# Altium schematic sheet EP4CE10F17C8N_Core.SchDoc
size A3; SheetNumber: 3; SheetTotal: 4
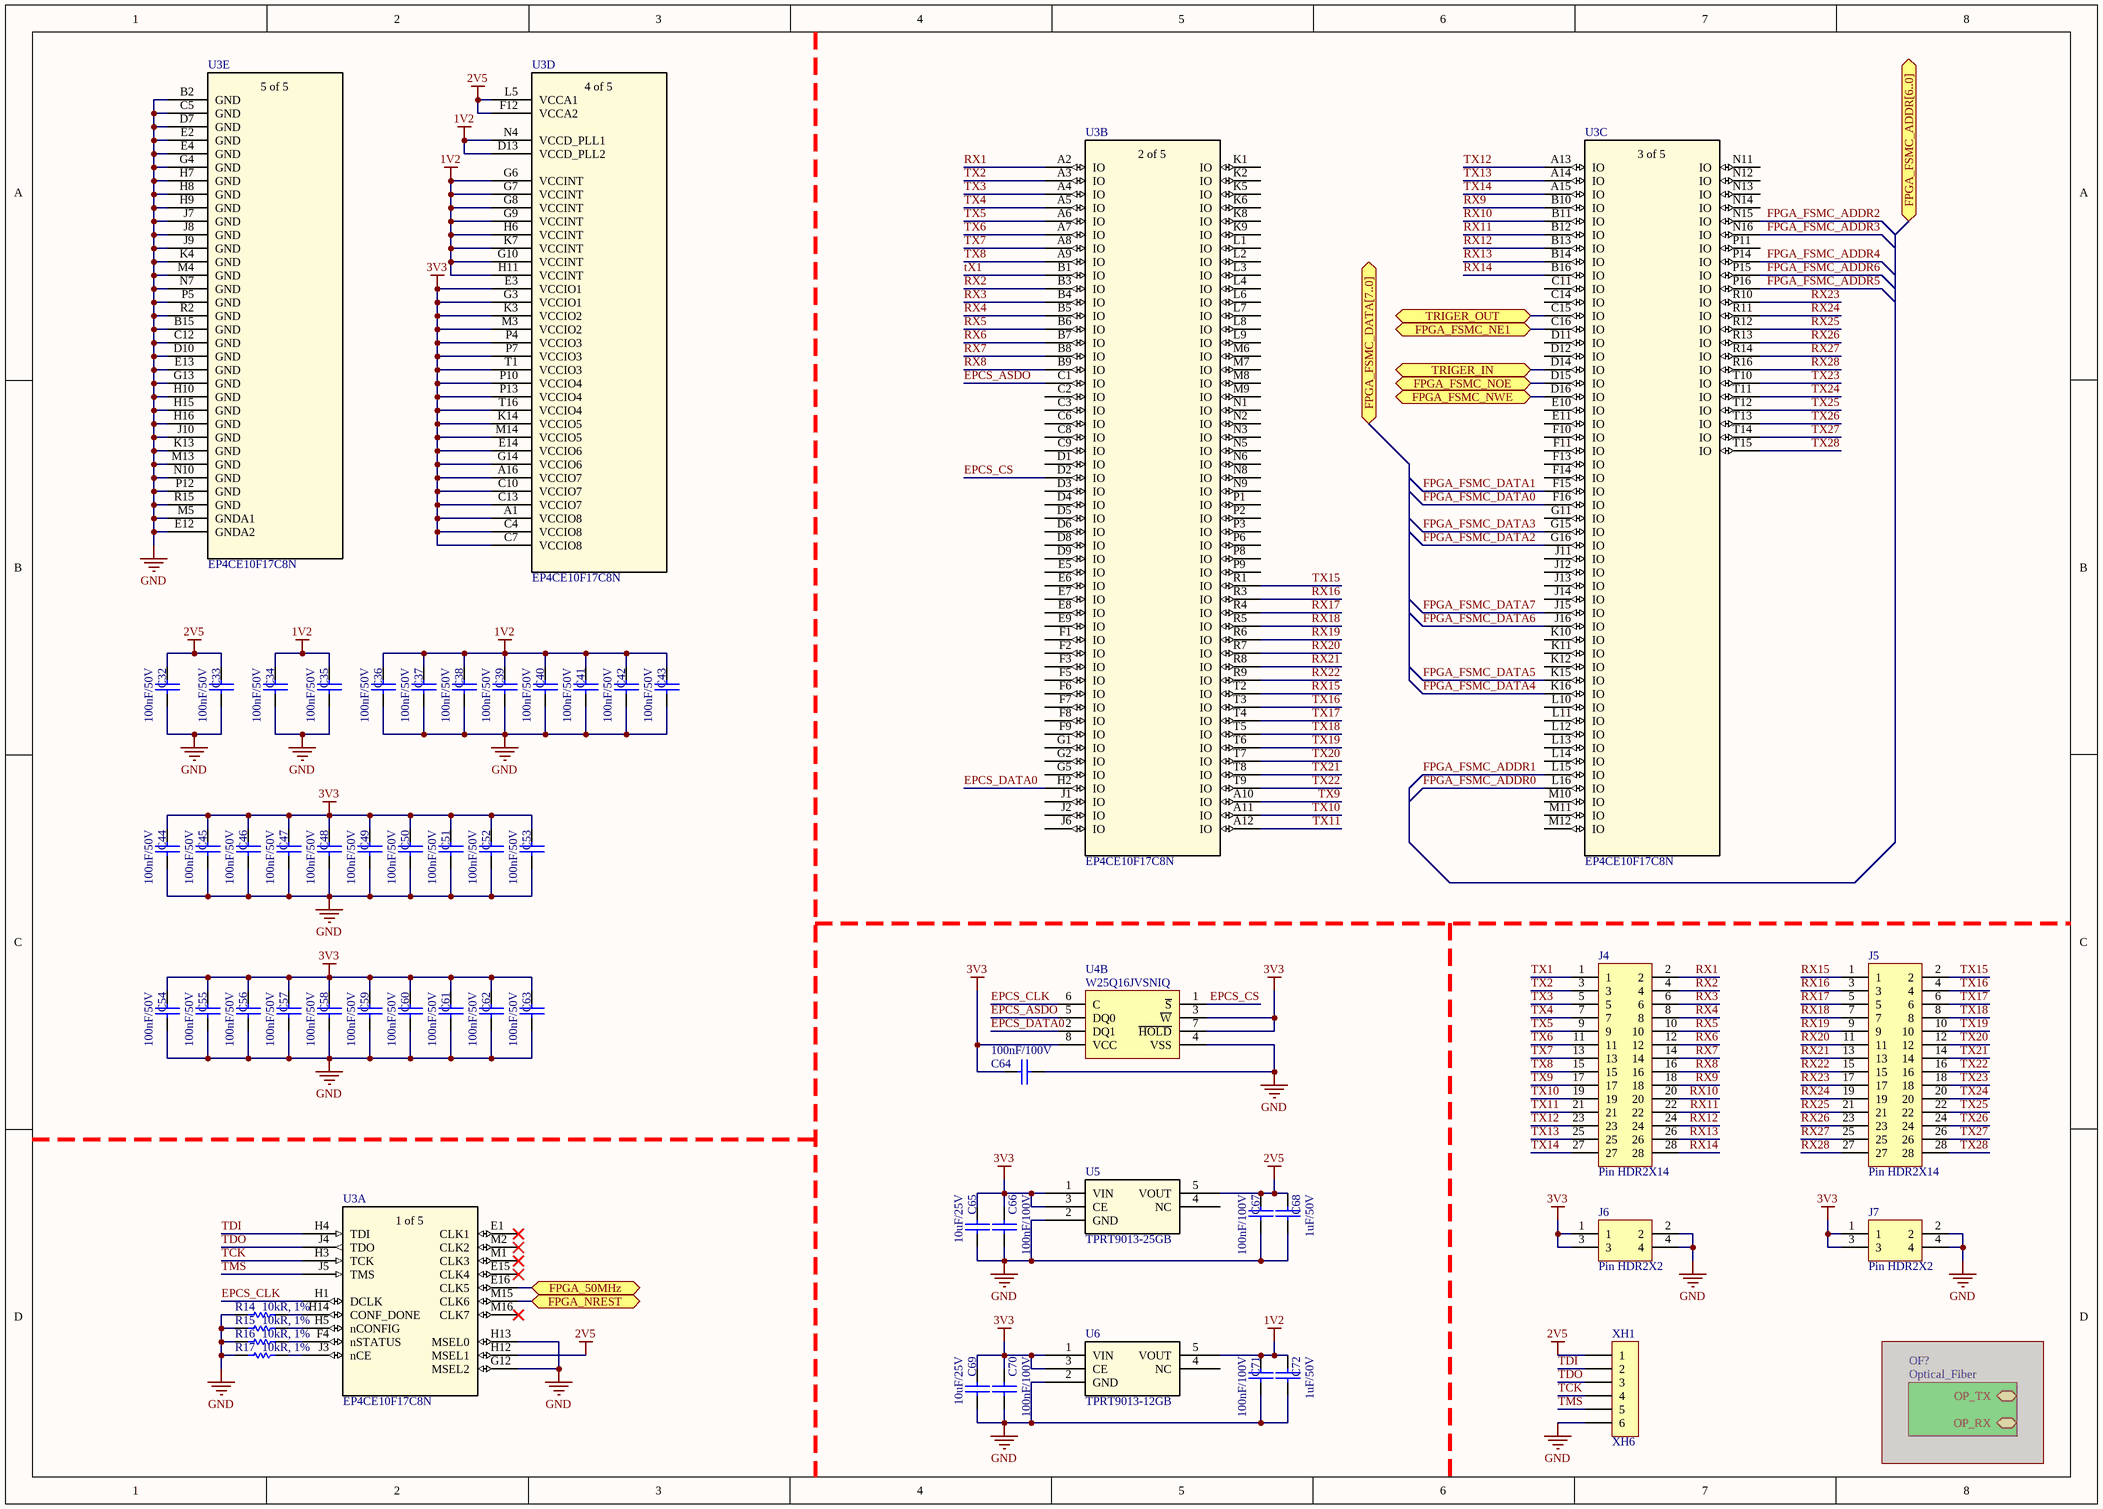
[diagram p0: EP4CE10F17C8N_Core.SchDoc]

## Parts
C32  100nF/50V  [0402C]
C33  100nF/50V  [0402C]
C34  100nF/50V  [0402C]
C35  100nF/50V  [0402C]
C36  100nF/50V  [0402C]
C37  100nF/50V  [0402C]
C38  100nF/50V  [0402C]
C39  100nF/50V  [0402C]
C40  100nF/50V  [0402C]
C41  100nF/50V  [0402C]
C42  100nF/50V  [0402C]
C43  100nF/50V  [0402C]
C44  100nF/50V  [0402C]
C45  100nF/50V  [0402C]
C46  100nF/50V  [0402C]
C47  100nF/50V  [0402C]
C48  100nF/50V  [0402C]
C49  100nF/50V  [0402C]
C50  100nF/50V  [0402C]
C51  100nF/50V  [0402C]
C52  100nF/50V  [0402C]
C53  100nF/50V  [0402C]
C54  100nF/50V  [0402C]
C55  100nF/50V  [0402C]
C56  100nF/50V  [0402C]
C57  100nF/50V  [0402C]
C58  100nF/50V  [0402C]
C59  100nF/50V  [0402C]
C60  100nF/50V  [0402C]
C61  100nF/50V  [0402C]
C62  100nF/50V  [0402C]
C63  100nF/50V  [0402C]
C64  100nF/100V  [0603C]
C65  10uF/25V  [0603C]
C66  100nF/100V  [0603C]
C67  100nF/100V  [0603C]
C68  1uF/50V  [0603C]
C69  10uF/25V  [0603C]
C70  100nF/100V  [0603C]
C71  100nF/100V  [0603C]
C72  1uF/50V  [0603C]
J4  Pin HDR2X14  [Pin HDR2X14/2.54mm-S]
J5  Pin HDR2X14  [Pin HDR2X14/2.54mm-S]
J6  Pin HDR2X2  [Pin HDR2X2/2.54mm-S]
J7  Pin HDR2X2  [Pin HDR2X2/2.54mm-S]
R14  10kR, 1%  [0402R]
R15  10kR, 1%  [0402R]
R16  10kR, 1%  [0402R]
R17  10kR, 1%  [0402R]
U3  EP4CE10F17C8N  [FBGA256]  (parts A,B,C,D,E of 5)
U4  W25Q16JVSNIQ  [SOIC8]  (part B of 2)
U5  TPRT9013-25GB  [SOT23-5]
U6  TPRT9013-12GB  [SOT23-5]
XH1  XH6  [XH6/2.54mm/180]

## Sub-sheets
OF? = Optical_Fiber (masked out): OP_TX (bidir), OP_RX (bidir)

## Ports
FPGA_50MHz (bidir, see Top[3C]), FPGA_FSMC_ADDR[6..0] (bidir, see Top[3B]), FPGA_FSMC_DATA[7..0] (bidir, see Top[3B]), FPGA_FSMC_NE1 (bidir, see Top[3B]), FPGA_FSMC_NOE (bidir, see Top[3B]), FPGA_FSMC_NWE (bidir, see Top[3B]), FPGA_NREST (bidir, see Top[3C]), TRIGER_IN (bidir, see Top[3C], STM32F407ZET6_Core[5D]), TRIGER_OUT (bidir, see Top[3C], STM32F407ZET6_Core[5D])

## Nets
1V2: C34.2 C35.2 C36.2 C37.2 C38.2 C39.2 C40.2 C41.2 C42.2 C43.2 C71.2 C72.2 U3.D13(VCCD_PLL2) U3.G6(VCCINT) U3.G7(VCCINT) U3.G8(VCCINT) U3.G9(VCCINT) U3.G10(VCCINT) U3.H6(VCCINT) U3.H11(VCCINT) U3.K7(VCCINT) U3.N4(VCCD_PLL1) U6.5(VOUT)
2V5: C32.2 C33.2 C67.2 C68.2 U3.F12(VCCA2) U3.H12(MSEL1) U3.L5(VCCA1) U5.5(VOUT) XH1.1
3V3: C44.2 C45.2 C46.2 C47.2 C48.2 C49.2 C50.2 C51.2 C52.2 C53.2 C54.2 C55.2 C56.2 C57.2 C58.2 C59.2 C60.2 C61.2 C62.2 C63.2 C64.2 C65.1 C66.2 C69.1 C70.2 J6.1 J6.3 J7.1 J7.3 U3.A1(VCCIO8) U3.A16(VCCIO7) U3.C4(VCCIO8) U3.C7(VCCIO8) U3.C10(VCCIO7) U3.C13(VCCIO7) U3.E3(VCCIO1) U3.E14(VCCIO6) U3.G3(VCCIO1) U3.G14(VCCIO6) U3.K3(VCCIO2) U3.K14(VCCIO5) U3.M3(VCCIO2) U3.M14(VCCIO5) U3.P4(VCCIO3) U3.P7(VCCIO3) U3.P10(VCCIO4) U3.P13(VCCIO4) U3.T1(VCCIO3) U3.T16(VCCIO4) U4.3(~{W}) U4.7(~{HOLD}) U4.8(VCC) U5.1(VIN) U5.3(CE) U6.1(VIN) U6.3(CE)
GND: C32.1 C33.1 C34.1 C35.1 C36.1 C37.1 C38.1 C39.1 C40.1 C41.1 C42.1 C43.1 C44.1 C45.1 C46.1 C47.1 C48.1 C49.1 C50.1 C51.1 C52.1 C53.1 C54.1 C55.1 C56.1 C57.1 C58.1 C59.1 C60.1 C61.1 C62.1 C63.1 C64.1 C65.2 C66.1 C67.1 C68.1 C69.2 C70.1 C71.1 C72.1 J6.2 J6.4 J7.2 J7.4 R14.1 R15.1 R16.1 R17.1 U3.B2(GND) U3.B15(GND) U3.C5(GND) U3.C12(GND) U3.D7(GND) U3.D10(GND) U3.E2(GND) U3.E4(GND) U3.E12(GNDA2) U3.E13(GND) U3.G4(GND) U3.G12(MSEL2) U3.G13(GND) U3.H7(GND) U3.H8(GND) U3.H9(GND) U3.H10(GND) U3.H13(MSEL0) U3.H15(GND) U3.H16(GND) U3.J7(GND) U3.J8(GND) U3.J9(GND) U3.J10(GND) U3.K4(GND) U3.K13(GND) U3.M4(GND) U3.M5(GNDA1) U3.M13(GND) U3.N7(GND) U3.N10(GND) U3.P5(GND) U3.P12(GND) U3.R2(GND) U3.R15(GND) U4.4(VSS) U5.2(GND) U6.2(GND) XH1.6
EPCS_ASDO: U3.C1(IO) U4.5(DQ0)
EPCS_CLK: U3.H1(DCLK) U4.6(C)
EPCS_CS: U3.D2(IO) U4.1(~{S})
EPCS_DATA0: U3.H2(IO) U4.2(DQ1)
FPGA_50MHz: U3.E16(CLK5) ; port FPGA_50MHz
FPGA_FSMC_ADDR0: U3.L16(IO)
FPGA_FSMC_ADDR1: U3.L15(IO)
FPGA_FSMC_ADDR2: U3.N15(IO)
FPGA_FSMC_ADDR3: U3.N16(IO)
FPGA_FSMC_ADDR4: U3.P14(IO)
FPGA_FSMC_ADDR5: U3.P16(IO)
FPGA_FSMC_ADDR6: U3.P15(IO)
FPGA_FSMC_DATA0: U3.F16(IO)
FPGA_FSMC_DATA1: U3.F15(IO)
FPGA_FSMC_DATA2: U3.G16(IO)
FPGA_FSMC_DATA3: U3.G15(IO)
FPGA_FSMC_DATA4: U3.K16(IO)
FPGA_FSMC_DATA5: U3.K15(IO)
FPGA_FSMC_DATA6: U3.J16(IO)
FPGA_FSMC_DATA7: U3.J15(IO)
FPGA_FSMC_NE1: U3.C16(IO) ; port FPGA_FSMC_NE1
FPGA_FSMC_NOE: U3.D15(IO) ; port FPGA_FSMC_NOE
FPGA_FSMC_NWE: U3.D16(IO) ; port FPGA_FSMC_NWE
FPGA_NREST: U3.M15(CLK6) ; port FPGA_NREST
RX1: J4.2 U3.A2(IO)
RX2: J4.4 U3.B3(IO)
RX3: J4.6 U3.B4(IO)
RX4: J4.8 U3.B5(IO)
RX5: J4.10 U3.B6(IO)
RX6: J4.12 U3.B7(IO)
RX7: J4.14 U3.B8(IO)
RX8: J4.16 U3.B9(IO)
RX9: J4.18 U3.B10(IO)
RX10: J4.20 U3.B11(IO)
RX11: J4.22 U3.B12(IO)
RX12: J4.24 U3.B13(IO)
RX13: J4.26 U3.B14(IO)
RX14: J4.28 U3.B16(IO)
RX15: J5.1 U3.T2(IO)
RX16: J5.3 U3.R3(IO)
RX17: J5.5 U3.R4(IO)
RX18: J5.7 U3.R5(IO)
RX19: J5.9 U3.R6(IO)
RX20: J5.11 U3.R7(IO)
RX21: J5.13 U3.R8(IO)
RX22: J5.15 U3.R9(IO)
RX23: J5.17 U3.R10(IO)
RX24: J5.19 U3.R11(IO)
RX25: J5.21 U3.R12(IO)
RX26: J5.23 U3.R13(IO)
RX27: J5.25 U3.R14(IO)
RX28: J5.27 U3.R16(IO)
TCK: U3.H3(TCK) XH1.4
TDI: U3.H4(TDI) XH1.2
TDO: U3.J4(TDO) XH1.3
TMS: U3.J5(TMS) XH1.5
TRIGER_IN: U3.D14(IO) ; port TRIGER_IN
TRIGER_OUT: U3.C15(IO) ; port TRIGER_OUT
tX1: J4.1 U3.B1(IO)
TX2: J4.3 U3.A3(IO)
TX3: J4.5 U3.A4(IO)
TX4: J4.7 U3.A5(IO)
TX5: J4.9 U3.A6(IO)
TX6: J4.11 U3.A7(IO)
TX7: J4.13 U3.A8(IO)
TX8: J4.15 U3.A9(IO)
TX9: J4.17 U3.A10(IO)
TX10: J4.19 U3.A11(IO)
TX11: J4.21 U3.A12(IO)
TX12: J4.23 U3.A13(IO)
TX13: J4.25 U3.A14(IO)
TX14: J4.27 U3.A15(IO)
TX15: J5.2 U3.R1(IO)
TX16: J5.4 U3.T3(IO)
TX17: J5.6 U3.T4(IO)
TX18: J5.8 U3.T5(IO)
TX19: J5.10 U3.T6(IO)
TX20: J5.12 U3.T7(IO)
TX21: J5.14 U3.T8(IO)
TX22: J5.16 U3.T9(IO)
TX23: J5.18 U3.T10(IO)
TX24: J5.20 U3.T11(IO)
TX25: J5.22 U3.T12(IO)
TX26: J5.24 U3.T13(IO)
TX27: J5.26 U3.T14(IO)
TX28: J5.28 U3.T15(IO)
NetR14_2: R14.2 U3.H14(CONF_DONE)
NetR15_2: R15.2 U3.H5(nCONFIG)
NetR16_2: R16.2 U3.F4(nSTATUS)
NetR17_2: R17.2 U3.J3(nCE)

Not connected (* = marked no-connect by the designer): U3 C2(IO) C3(IO) C6(IO) C8(IO) C9(IO) C11(IO) C14(IO) D1(IO) D3(IO) D4(IO) D5(IO) D6(IO) D8(IO) D9(IO) D11(IO) D12(IO) E1(CLK1)* E5(IO) E6(IO) E7(IO) E8(IO) E9(IO) E10(IO) E11(IO) E15(CLK4)* F1(IO) F2(IO) F3(IO) F5(IO) F6(IO) F7(IO) F8(IO) F9(IO) F10(IO) F11(IO) F13(IO) F14(IO) G1(IO) G2(IO) G5(IO) G11(IO) J1(IO) J2(IO) J6(IO) J11(IO) J12(IO) J13(IO) J14(IO) K1(IO) K2(IO) K5(IO) K6(IO) K8(IO) K9(IO) K10(IO) K11(IO) K12(IO) L1(IO) L2(IO) L3(IO) L4(IO) L6(IO) L7(IO) L8(IO) L9(IO) L10(IO) L11(IO) L12(IO) L13(IO) L14(IO) M1(CLK3)* M2(CLK2)* M6(IO) M7(IO) M8(IO) M9(IO) M10(IO) M11(IO) M12(IO) M16(CLK7)* N1(IO) N2(IO) N3(IO) N5(IO) N6(IO) N8(IO) N9(IO) N11(IO) N12(IO) N13(IO) N14(IO) P1(IO) P2(IO) P3(IO) P6(IO) P8(IO) P9(IO) P11(IO); U5 4(NC); U6 4(NC)

## Notes on the sheet
- (in symbol EP4CE10F17C8N, part A) 1 of 5
- (in symbol EP4CE10F17C8N, part B) 2 of 5
- (in symbol EP4CE10F17C8N, part C) 3 of 5
- (in symbol EP4CE10F17C8N, part D) 4 of 5
- (in symbol EP4CE10F17C8N, part E) 5 of 5

## Library data of the parts
C32-C63 = CAP: CC0402KRX7R9BB104
C64 C66 C67 C70 C71 = CAP: CC0603KRX7R9BB104
C65 C69 = CAP: CC0603MRX5R8BB106
C68 C72 = CAP: CC0603KRX7R9BB105
R14-R17 = RES: RC0402FR-0710KL
U3 = EP4CE10F17C8N: No Description Available; Manufacturer_Name: Intel; Copyright: Copyright (C) 2025 Ultra Librarian. All rights reserved.; Manufacturer_Part_Number: EP4CE10F17C8N; RefDes: RefDes; Type: Type
U4 = W25Q16
U5 U6 = TPRT9013-XXGB: No Description Available; Manufacturer_Name: Tech Public; Manufacturer_Part_Number: TPRT9013-33GB; Type: Power Management; Copyright: Copyright (C) 2025 Ultra Librarian. All rights reserved.; RefDes: RefDes